# EAGLE design dual_output_buck_regulator (EAGLE 9.4.2)
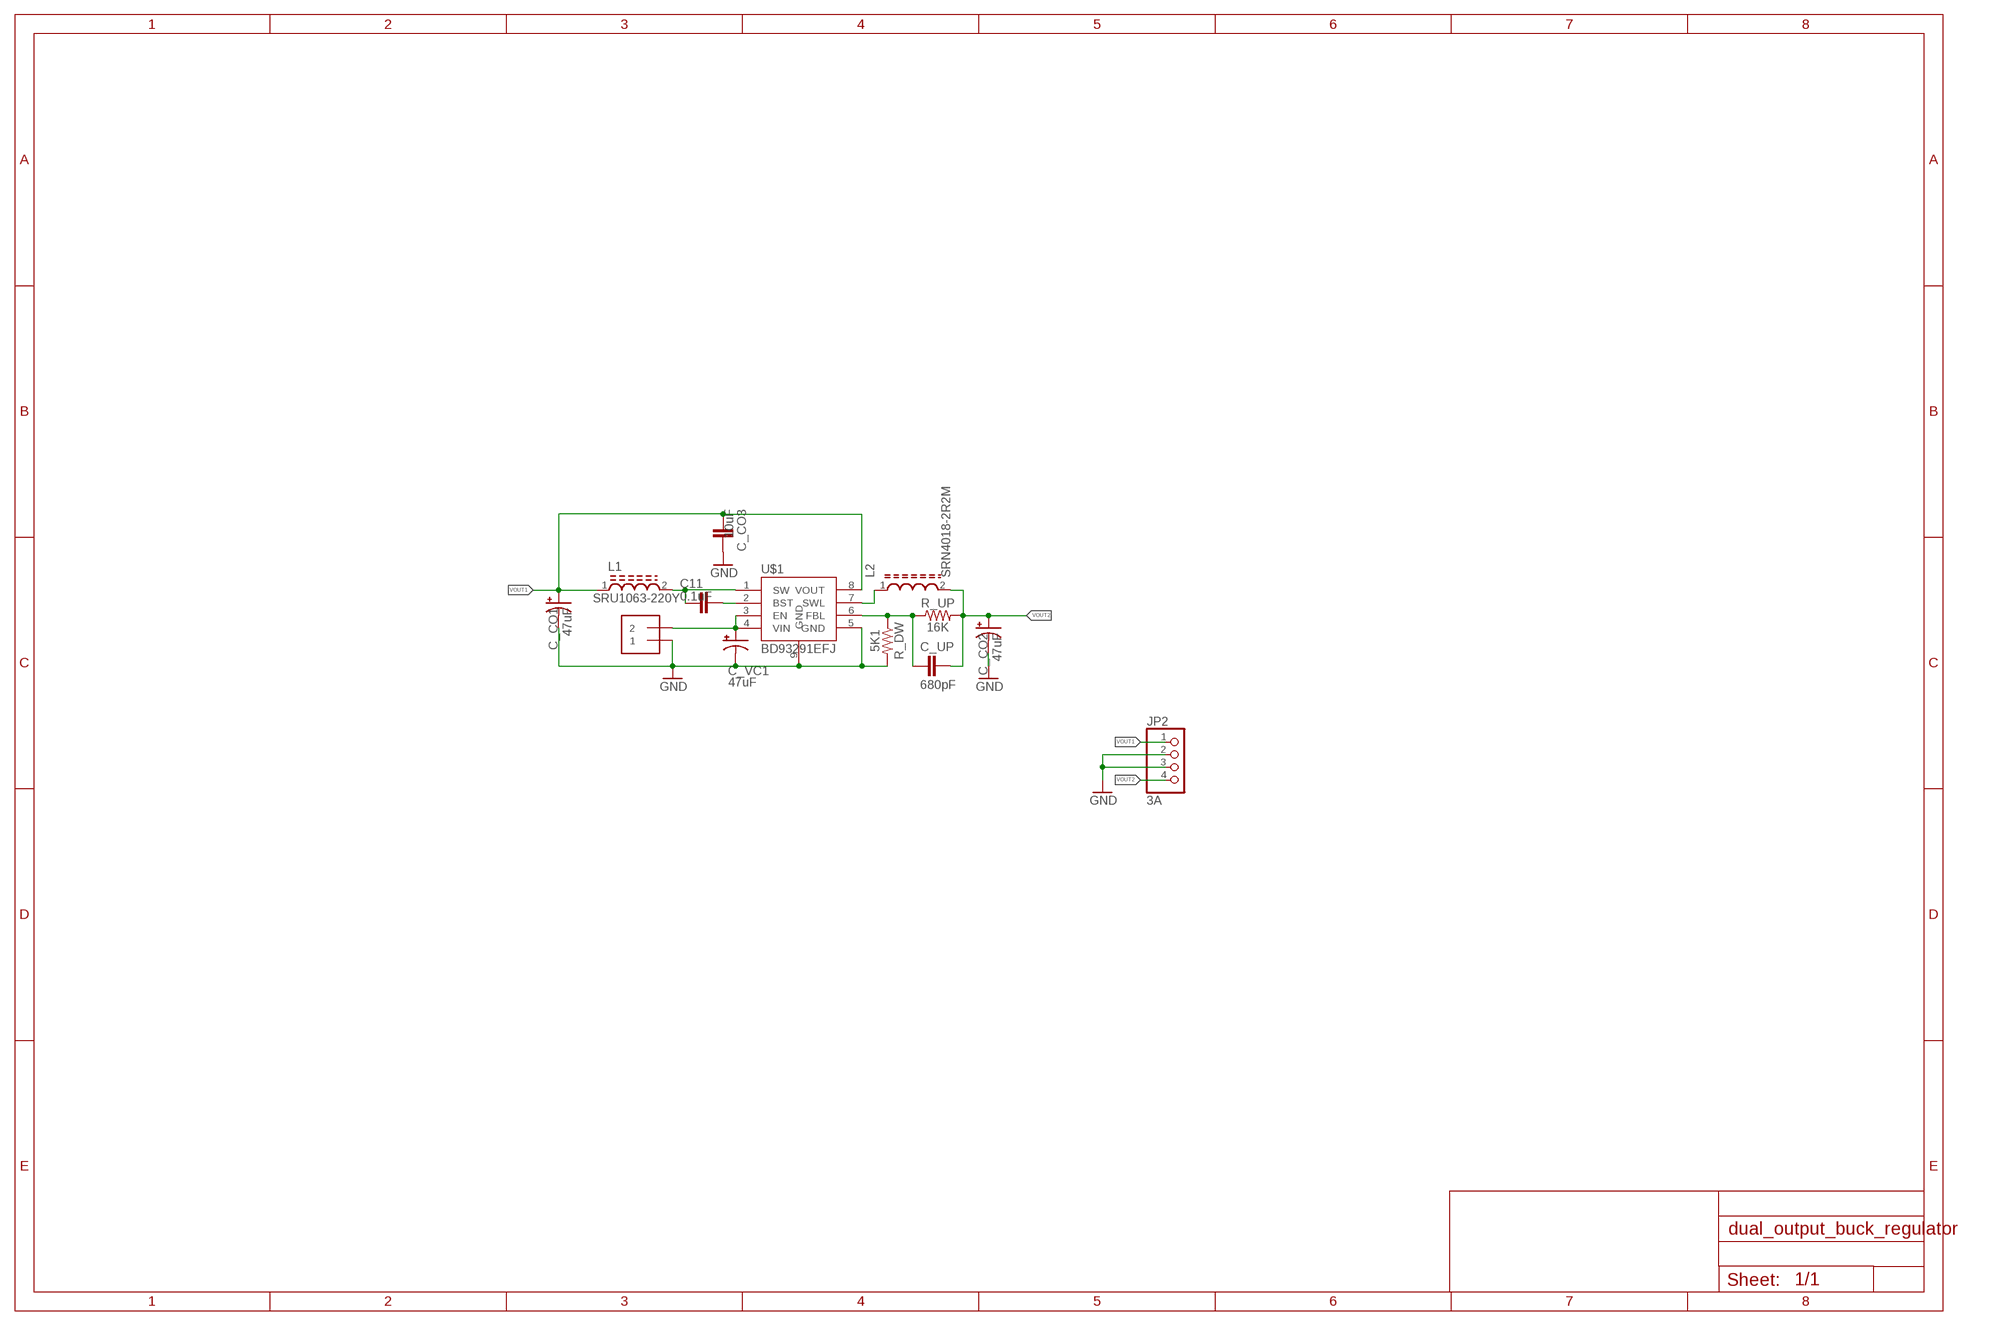
[diagram p0: schematic, sheet 1]

## Parts
C11  0.1uF  0.1UF-0603-25V-(+80/-20%)  [0603]
C_CO1  47uF  22UF-POLAR-PANASONIC_C-35V-20%  [PANASONIC_C]
C_CO2  47uF  22UF-POLAR-PANASONIC_C-35V-20%  [PANASONIC_C]
C_CO3  10uF  0.1UF-0603-25V-(+80/-20%)  [0603]
C_UP  680pF  0.1UF-0603-25V-(+80/-20%)  [0603]
C_VC1  47uF  22UF-POLAR-PANASONIC_C-35V-20%  [PANASONIC_C]
J1  1X2-3.5MM  [1X2-3.5MM]
JP2  3A  PINHD-1X4  [1X04]
L1  SRU1063-220Y  [IND_SRU1063-220Y]
L2  SRN4018-2R2M  SRN4018-2R7M  [INDP4040X180N]
R_DW  5K1  10KOHM-0603-1/10W-1%  [0603]
R_UP  16K  10KOHM-0603-1/10W-1%  [0603]
U$1  BD93291EFJ  [SOIC127P600X100-9N]

## Nets
GND: C_CO1.- C_CO2.- C_CO3.1 C_VC1.- J1.1 JP2.2 JP2.3 R_DW.2 U$1.5(GND) U$1.9(GND)
N$1: C_VC1.+ J1.2 U$1.3(EN) U$1.4(VIN)
N$2: C11.1 U$1.2(BST)
N$3: C11.2 L1.2 U$1.1(SW)
N$4: C_UP.2 R_DW.1 R_UP.1 U$1.6(FBL)
N$6: L2.1 U$1.7(SWL)
VOUT1: C_CO1.+ C_CO3.2 JP2.1 L1.1 U$1.8(VOUT)
VOUT2: C_CO2.+ C_UP.1 JP2.4 L2.2 R_UP.2

## Library data of the parts
C11 = SparkFun-Capacitors:0.1UF: 0.1µF ceramic capacitors A capacitor is a passive two-terminal electrical component used to store electrical energy temporarily in an electric field.; PROD_ID: CAP-00810
C_CO1 C_CO2 C_VC1 = SparkFun-Capacitors:22UF-POLAR: 22µF polarized capacitors A capacitor is a passive two-terminal electrical component used to store electrical energy temporarily in an electric field.; PROD_ID: CAP-08618; VALUE: 22uF
C_CO3 C_UP = SparkFun-Capacitors:0.1UF: 0.1µF ceramic capacitors A capacitor is a passive two-terminal electrical component used to store electrical energy temporarily in an electric field.; PROD_ID: CAP-00810; VALUE: 0.1uF
J1 = adafruit:1X2: 3.5mm Terminal block http://www.ladyada.net/library/pcb/eaglelibrary.html
JP2 = pinhead:PINHD-1X4: PIN HEADER
L1 = SRU1063-220Y:SRU1063-220Y: Ind Power Shielded Wirewound 22uH 30% 100KHz 15Q-Factor Ferrite 3A T/R; AVAILABILITY: Unavailable; DESCRIPTION: 22µH Shielded Wirewound Inductor 3A 60mOhm Max Nonstandard; MF: Bourns; MP: SRU1063-220Y; PACKAGE: 1008 Bourns; PRICE: None
L2 = SRN4018-2R7M:SRN4018-2R7M: Inductor Power Semi-Shielded Wirewound 47uH 20% 100KHz Ferrite 600mA 780mOhm DCR 1515 T/R; AVAILABILITY: Unavailable; DESCRIPTION: 2.7µH Semi-Shielded Wirewound Inductor 2.3A 52mOhm Max Nonstandard; MF: Bourns; MP: SRN4018-2R7M; PACKAGE: Nonstandard Bourns; PRICE: None
R_DW R_UP = SparkFun-Resistors:10KOHM: 10kΩ resistor A resistor is a passive two-terminal electrical component that implements electrical resistance as a circuit element. Resistors act to reduce current flow, and, at the same time, act to lower voltage levels within circuits. - Wikipedia; PROD_ID: RES-00824; VALUE: 10k
U$1 = SOIC127P600X100-9N:BD93291EFJ

## Board
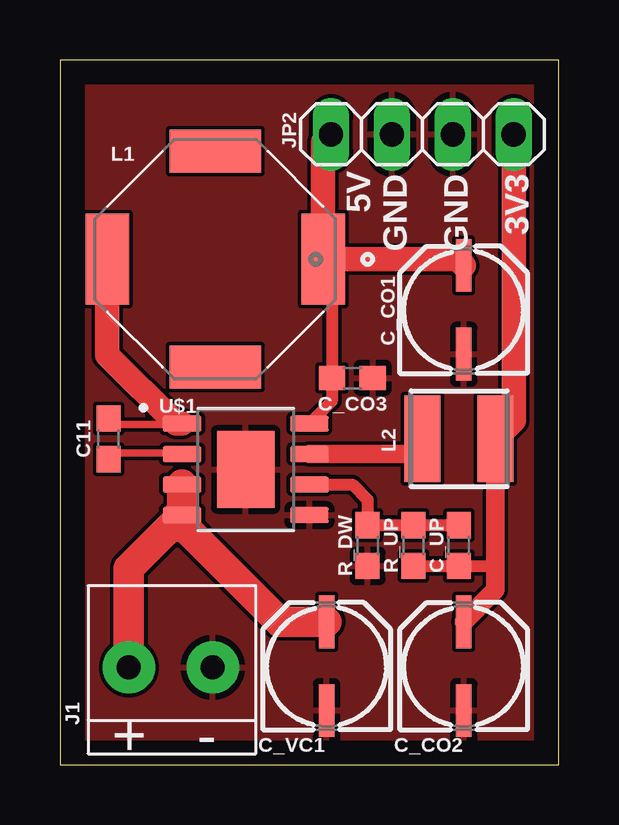
[diagram p1: board, top side]
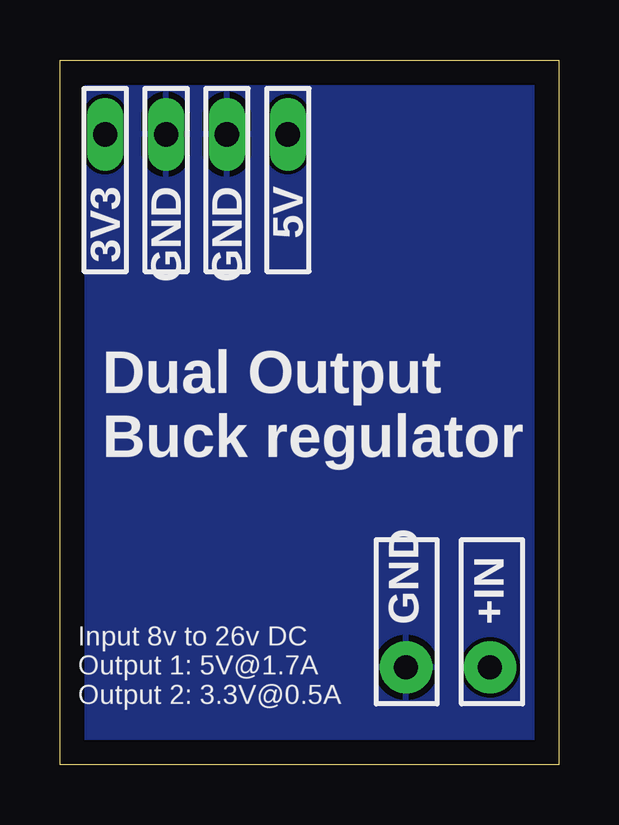
[diagram p2: board, bottom side, seen from below]

Size 20.81 x 29.39 mm. Coordinates in mm from the lower left corner, seen from the top.
Outline: 0,0 20.81,0 20.81,29.39 0,29.39 0,0
Copper layers (1*16): Top 0.035mm / dielectric 1.5mm / Bottom 0.035mm
Design rules "default": minimum track width 6mil, minimum drill 0.35mm, track to track 6mil, track to pad 6mil, pad to pad 6mil, via to via 6mil, smd to smd 6mil, copper to edge 40mil, drill to drill 6mil, minimum pad ring 10mil, minimum via ring 8mil, stop-mask expansion 4mil, vias tented up to drill 0mil, thermal gap 10mil

### Footprints (pad centres in the part's own frame; a part is rotated, then mirrored left to right if it is on the bottom)
0603 = smd 1.1 x 1: 1 -0.85,0; 2 0.85,0
PANASONIC_C = smd 2.2 x 0.65: + 1.9,-0.2; - -1.8,-0.2
1X2-3.5MM = drill 1 pad 2.184: 1 1.8,0; 2 -1.7,0
1X04 = drill 1.016 long: 1 -3.81,0; 2 -1.27,0; 3 1.27,0; 4 3.81,0
IND_SRU1063-220Y = smd 1.8 x 3.8: 1 -4.5,0; 2 4.5,0 | smd 3.8 x 1.8: 3 0,-4.5; 4 0,4.5
INDP4040X180N = smd 1.5 x 3.6: 1 -1.525,0; 2 1.525,0
SOIC127P600X100-9N = smd 1.61 x 0.66: 1 -2.655,1.905; 2 -2.655,0.635; 3 -2.655,-0.635; 4 -2.655,-1.905; 5 2.655,-1.905; 6 2.655,-0.635; 7 2.655,0.635; 8 2.655,1.905 | smd 2.4 x 3.2: 9 0,0

### Placement (x,y rotation side)
C11  2.03,13.59 90 top
C_CO1  16.64,18.92 90 top
C_CO2  16.64,4.06 90 top
C_CO3  12.19,16.13 180 top
C_UP  16.64,9.14 90 top
C_VC1  10.92,4.06 90 top
J1  4.57,4.06 0 top
JP2  15.11,26.29 0 top
L1  6.48,21.08 180 top
L2  16.64,13.59 0 top
R_DW  12.83,9.14 270 top
R_UP  14.73,9.14 270 top
U$1  7.75,12.32 0 top

### Tracks (layer width: path | path; a pad name or v marks a point on that pad's centre or on a via)
GND
  pour Top: -2.54,30.48 22.86,30.48 22.86,-2.54 -2.54,-2.54
  pour Bottom: -2.54,30.73 22.86,30.73 22.86,-2.54 -2.54,-2.54
N$1
  Top 1.27: U$1.3 U$1.4 2.87,8.19 J1.2 | C_VC1.+ 9.16,5.96 5.09,10.03
  Top 1.524: 5.09,10.03 U$1.4
N$2
  Top 0.305: C11.1 2.29,12.99 5.05,12.99 U$1.2
N$3
  Top 0.305: C11.2 2.29,14.19 5.05,14.19 U$1.1
  Top 1.016: U$1.1 4.84,14.22 1.98,17.09 L1.2
N$4
  Top 0.508: U$1.6 12.19,11.68 12.83,11.05 R_DW.1 R_UP.1 C_UP.2
N$6
  Top 0.508: 14.48,12.95 L2.1
  Top 0.762: U$1.7 14.48,12.95
VOUT1
  Top 0.508: L1.1 11.34,20.72 C_CO3.2 11.34,15.16 U$1.8
  Top 1.016: C_CO1.+ 16.58,21.08 L1.1 10.98,25.96 JP2.1
VOUT2
  Top 0.508: R_UP.2 C_UP.1 17.95,8.29 18.16,8.51
  Top 0.762: L2.2 18.16,8.51 18.16,7.29 C_CO2.+
  Top 1.016: L2.2 18.92,14.35 JP2.4

### Text on the board
tPlace: 5V | GND | GND | 3V3 | + | -
bPlace: 5V | GND | GND | 3V3 | Dual Output / Buck regulator | +IN | GND | Input 8v to 26v DC / Output 1: 5V@1.7A / Output 2: 3.3V@0.5A